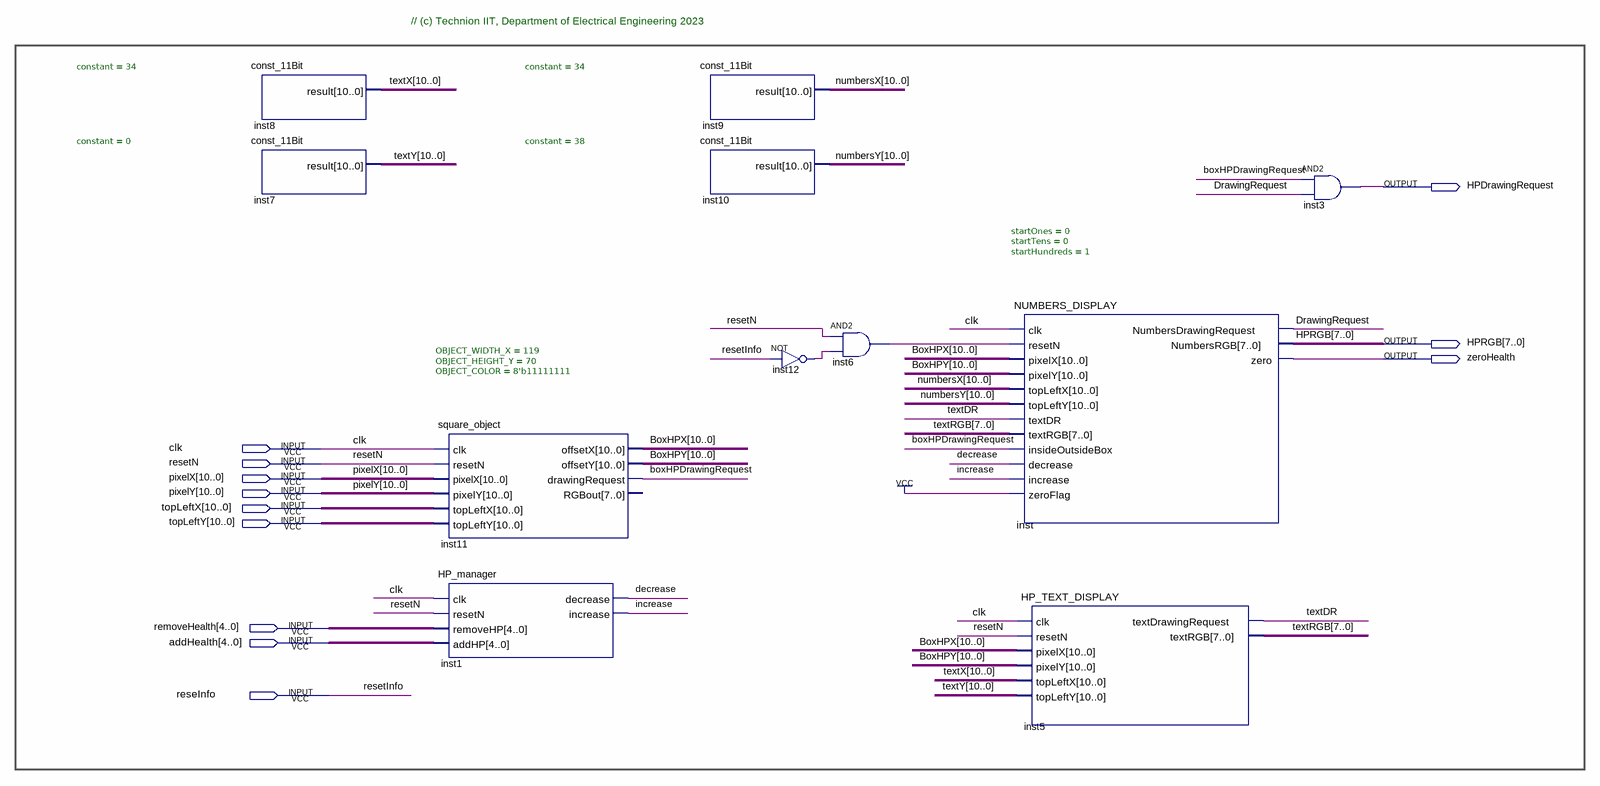
[diagram p0: schematic sheet]
// Quartus schematic HP_DISPLAY.bdf as structural Verilog: 11 symbols, 12 pins
module HP_DISPLAY (
  input  clk,
  input  resetN,
  input  [10:0] pixelX,
  input  [10:0] pixelY,
  input  [10:0] topLeftX,
  input  [10:0] topLeftY,
  input  [4:0] removeHealth,
  input  [4:0] addHealth,
  input  reseInfo,
  output HPDrawingRequest,
  output [7:0] HPRGB,
  output zeroHealth
);

  wire boxHPDrawingRequest, decrease, DrawingRequest, increase, inst6_out, inst12_out, textDR;
  wire [7:0] textRGB;
  wire [10:0] BoxHPX, BoxHPY, numbersX, numbersY, textX, textY;

  const_11Bit #(.constant(34)) inst8 (.result(textX));
  const_11Bit #(.constant(0)) inst7 (.result(textY));
  square_object #(.OBJECT_WIDTH_X(119), .OBJECT_HEIGHT_Y(70), .OBJECT_COLOR(8'b11111111)) inst11 (
    .clk(clk), .resetN(resetN), .pixelX(pixelX), .pixelY(pixelY), .topLeftX(topLeftX), .topLeftY(topLeftY),
    .offsetX(BoxHPX), .offsetY(BoxHPY), .drawingRequest(boxHPDrawingRequest));  // open: RGBout
  HP_manager inst1 (
    .clk(clk), .resetN(resetN), .removeHP(removeHealth), .addHP(addHealth), .decrease(decrease),
    .increase(increase));
  const_11Bit #(.constant(34)) inst9 (.result(numbersX));
  const_11Bit #(.constant(38)) inst10 (.result(numbersY));
  not inst12 (inst12_out, reseInfo);
  and inst6 (inst6_out, resetN, inst12_out);
  NUMBERS_DISPLAY #(.startOnes(0), .startTens(0), .startHundreds(1)) inst (
    .clk(clk), .resetN(inst6_out), .pixelX(BoxHPX), .pixelY(BoxHPY), .topLeftX(numbersX),
    .topLeftY(numbersY), .textDR(textDR), .textRGB(textRGB), .insideOutsideBox(boxHPDrawingRequest),
    .decrease(decrease), .increase(increase), .zeroFlag(1'b1), .NumbersDrawingRequest(DrawingRequest),
    .NumbersRGB(HPRGB), .zero(zeroHealth));
  HP_TEXT_DISPLAY inst5 (
    .clk(clk), .resetN(resetN), .pixelX(BoxHPX), .pixelY(BoxHPY), .topLeftX(textX), .topLeftY(textY),
    .textDrawingRequest(textDR), .textRGB(textRGB));
  and inst3 (HPDrawingRequest, boxHPDrawingRequest, DrawingRequest);

  // Other names for the same wires on the sheet: resetInfo = reseInfo

  // Notes on the sheet:
  //   // (c) Technion IIT, Department of Electrical Engineering 2023
endmodule
